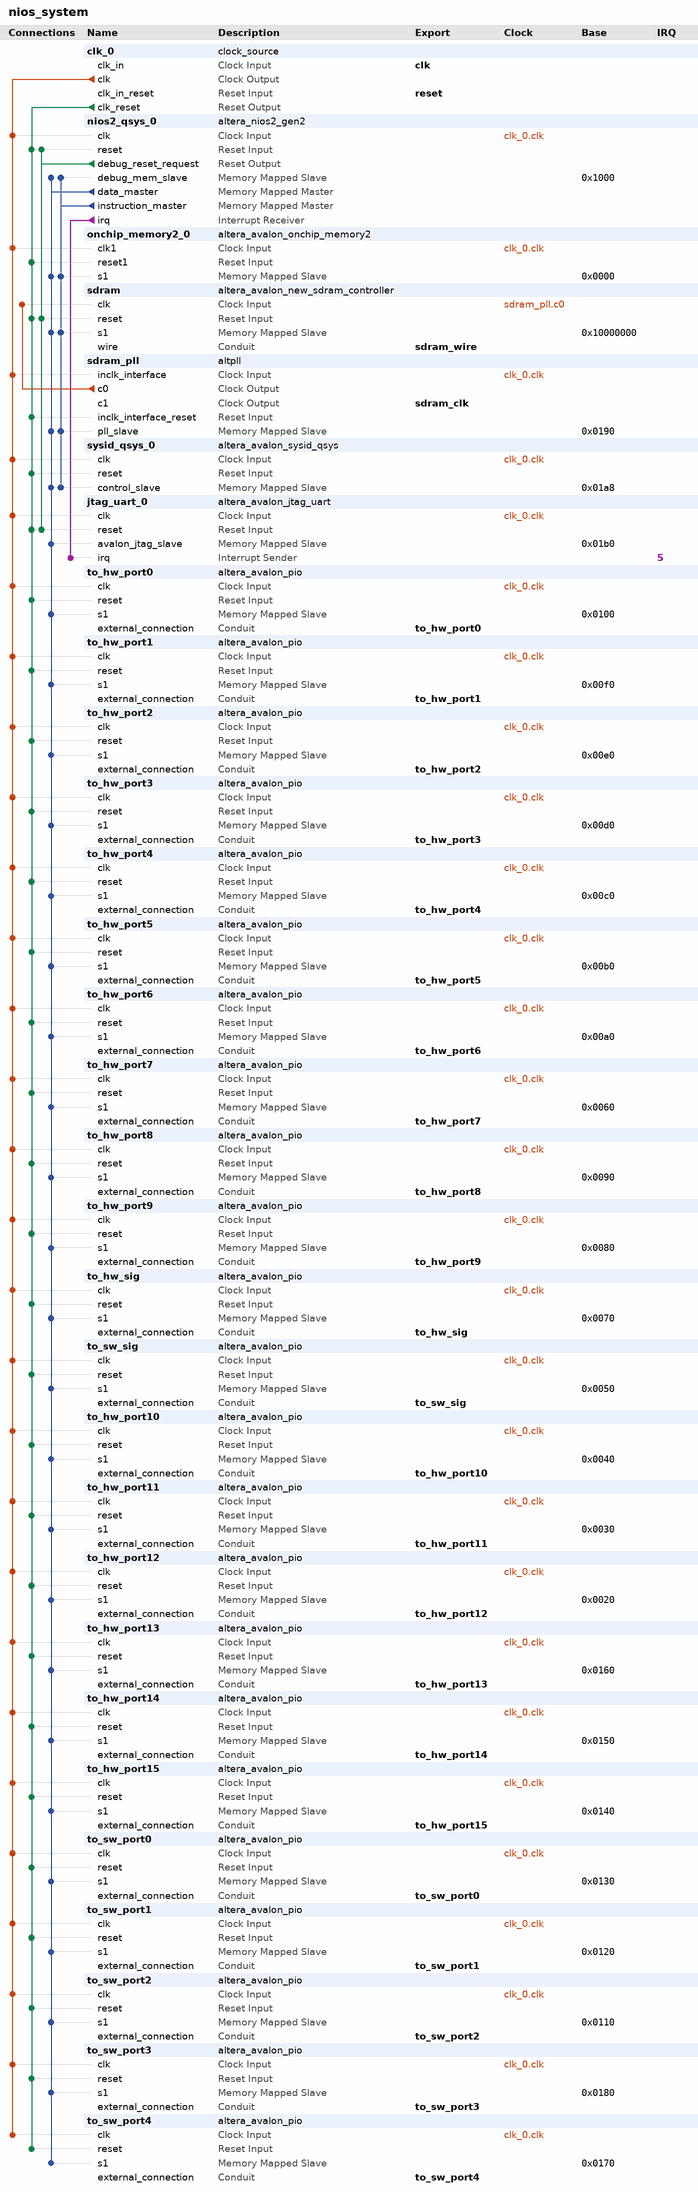
[diagram p0: system contents]
# Platform Designer (Qsys) system nios_system, Cyclone IV E EP4CE115F29C7
# Parameters at their usual value, and those the tool derives, are not listed.
package require -exact qsys 15.0
create_system nios_system
set_project_property DEVICE_FAMILY {Cyclone IV E}
set_project_property DEVICE EP4CE115F29C7

add_instance clk_0 clock_source 15.0
set_instance_parameter_value clk_0 clockFrequency 50000000

add_instance nios2_qsys_0 altera_nios2_gen2 15.0
set_instance_parameter_value nios2_qsys_0 dcache_size 2048
set_instance_parameter_value nios2_qsys_0 exceptionSlave sdram.s1
set_instance_parameter_value nios2_qsys_0 icache_size 4096
set_instance_parameter_value nios2_qsys_0 impl Tiny
set_instance_parameter_value nios2_qsys_0 resetSlave sdram.s1

add_instance onchip_memory2_0 altera_avalon_onchip_memory2 15.0
set_instance_parameter_value onchip_memory2_0 dataWidth 16
set_instance_parameter_value onchip_memory2_0 dualPort false
set_instance_parameter_value onchip_memory2_0 initMemContent true
set_instance_parameter_value onchip_memory2_0 initializationFileName onchip_mem.hex
set_instance_parameter_value onchip_memory2_0 memorySize 16

add_instance sdram altera_avalon_new_sdram_controller 15.0
set_instance_parameter_value sdram TAC 5.5
set_instance_parameter_value sdram TRCD 20.0
set_instance_parameter_value sdram TRP 20.0
set_instance_parameter_value sdram casLatency 3
set_instance_parameter_value sdram columnWidth 10
set_instance_parameter_value sdram dataWidth 32
set_instance_parameter_value sdram generateSimulationModel false
set_instance_parameter_value sdram model single_Micron_MT48LC4M32B2_7_chip
set_instance_parameter_value sdram numberOfBanks 4
set_instance_parameter_value sdram numberOfChipSelects 1
set_instance_parameter_value sdram powerUpDelay 200.0
set_instance_parameter_value sdram refreshPeriod 7.8125
set_instance_parameter_value sdram rowWidth 13

add_instance sdram_pll altpll 15.0
set_instance_parameter_value sdram_pll CLK0_DIVIDE_BY 1
set_instance_parameter_value sdram_pll CLK0_MULTIPLY_BY 1
set_instance_parameter_value sdram_pll CLK1_DIVIDE_BY 1
set_instance_parameter_value sdram_pll CLK1_DUTY_CYCLE 50
set_instance_parameter_value sdram_pll CLK1_MULTIPLY_BY 1
set_instance_parameter_value sdram_pll CLK1_PHASE_SHIFT -3000
set_instance_parameter_value sdram_pll INCLK0_INPUT_FREQUENCY 20000
set_instance_parameter_value sdram_pll PORT_ARESET PORT_UNUSED
set_instance_parameter_value sdram_pll PORT_LOCKED PORT_UNUSED
set_instance_parameter_value sdram_pll PORT_clk1 PORT_USED
set_instance_parameter_value sdram_pll PORT_clk2 PORT_UNUSED
set_instance_parameter_value sdram_pll PORT_clk3 PORT_UNUSED

add_instance sysid_qsys_0 altera_avalon_sysid_qsys 15.0
set_instance_parameter_value sysid_qsys_0 id 0

add_instance jtag_uart_0 altera_avalon_jtag_uart 15.0
set_instance_parameter_value jtag_uart_0 simInteractiveOptions NO_INTERACTIVE_WINDOWS

add_instance to_hw_port0 altera_avalon_pio 15.0
set_instance_parameter_value to_hw_port0 direction Output
set_instance_parameter_value to_hw_port0 width 32

add_instance to_hw_port1 altera_avalon_pio 15.0
set_instance_parameter_value to_hw_port1 direction Output
set_instance_parameter_value to_hw_port1 width 32

add_instance to_hw_port2 altera_avalon_pio 15.0
set_instance_parameter_value to_hw_port2 direction Output
set_instance_parameter_value to_hw_port2 width 32

add_instance to_hw_port3 altera_avalon_pio 15.0
set_instance_parameter_value to_hw_port3 direction Output
set_instance_parameter_value to_hw_port3 width 32

add_instance to_hw_port4 altera_avalon_pio 15.0
set_instance_parameter_value to_hw_port4 direction Output
set_instance_parameter_value to_hw_port4 width 32

add_instance to_hw_port5 altera_avalon_pio 15.0
set_instance_parameter_value to_hw_port5 direction Output
set_instance_parameter_value to_hw_port5 width 32

add_instance to_hw_port6 altera_avalon_pio 15.0
set_instance_parameter_value to_hw_port6 direction Output
set_instance_parameter_value to_hw_port6 width 32

add_instance to_hw_port7 altera_avalon_pio 15.0
set_instance_parameter_value to_hw_port7 direction Output
set_instance_parameter_value to_hw_port7 width 32

add_instance to_hw_port8 altera_avalon_pio 15.0
set_instance_parameter_value to_hw_port8 direction Output
set_instance_parameter_value to_hw_port8 width 32

add_instance to_hw_port9 altera_avalon_pio 15.0
set_instance_parameter_value to_hw_port9 direction Output
set_instance_parameter_value to_hw_port9 width 32

add_instance to_hw_sig altera_avalon_pio 15.0
set_instance_parameter_value to_hw_sig direction Output
set_instance_parameter_value to_hw_sig width 2

add_instance to_sw_sig altera_avalon_pio 15.0
set_instance_parameter_value to_sw_sig direction Input
set_instance_parameter_value to_sw_sig width 2

add_instance to_hw_port10 altera_avalon_pio 15.0
set_instance_parameter_value to_hw_port10 direction Output
set_instance_parameter_value to_hw_port10 width 32

add_instance to_hw_port11 altera_avalon_pio 15.0
set_instance_parameter_value to_hw_port11 direction Output
set_instance_parameter_value to_hw_port11 width 32

add_instance to_hw_port12 altera_avalon_pio 15.0
set_instance_parameter_value to_hw_port12 direction Output
set_instance_parameter_value to_hw_port12 width 32

add_instance to_hw_port13 altera_avalon_pio 15.0
set_instance_parameter_value to_hw_port13 direction Output
set_instance_parameter_value to_hw_port13 width 32

add_instance to_hw_port14 altera_avalon_pio 15.0
set_instance_parameter_value to_hw_port14 direction Output
set_instance_parameter_value to_hw_port14 width 32

add_instance to_hw_port15 altera_avalon_pio 15.0
set_instance_parameter_value to_hw_port15 direction Output
set_instance_parameter_value to_hw_port15 width 32

add_instance to_sw_port0 altera_avalon_pio 15.0
set_instance_parameter_value to_sw_port0 direction Input
set_instance_parameter_value to_sw_port0 width 32

add_instance to_sw_port1 altera_avalon_pio 15.0
set_instance_parameter_value to_sw_port1 direction Input
set_instance_parameter_value to_sw_port1 width 32

add_instance to_sw_port2 altera_avalon_pio 15.0
set_instance_parameter_value to_sw_port2 direction Input
set_instance_parameter_value to_sw_port2 width 8

add_instance to_sw_port3 altera_avalon_pio 15.0
set_instance_parameter_value to_sw_port3 direction Input
set_instance_parameter_value to_sw_port3 width 16

add_instance to_sw_port4 altera_avalon_pio 15.0
set_instance_parameter_value to_sw_port4 direction Input
set_instance_parameter_value to_sw_port4 width 16

# connections
add_connection clk_0.clk jtag_uart_0.clk clock
add_connection clk_0.clk nios2_qsys_0.clk clock
add_connection clk_0.clk onchip_memory2_0.clk1 clock
add_connection clk_0.clk sdram_pll.inclk_interface clock
add_connection clk_0.clk sysid_qsys_0.clk clock
add_connection clk_0.clk to_hw_port0.clk clock
add_connection clk_0.clk to_hw_port1.clk clock
add_connection clk_0.clk to_hw_port2.clk clock
add_connection clk_0.clk to_hw_port3.clk clock
add_connection clk_0.clk to_hw_port4.clk clock
add_connection clk_0.clk to_hw_port5.clk clock
add_connection clk_0.clk to_hw_port6.clk clock
add_connection clk_0.clk to_hw_port7.clk clock
add_connection clk_0.clk to_hw_port8.clk clock
add_connection clk_0.clk to_hw_port9.clk clock
add_connection clk_0.clk to_hw_port10.clk clock
add_connection clk_0.clk to_hw_port11.clk clock
add_connection clk_0.clk to_hw_port12.clk clock
add_connection clk_0.clk to_hw_port13.clk clock
add_connection clk_0.clk to_hw_port14.clk clock
add_connection clk_0.clk to_hw_port15.clk clock
add_connection clk_0.clk to_hw_sig.clk clock
add_connection clk_0.clk to_sw_port0.clk clock
add_connection clk_0.clk to_sw_port1.clk clock
add_connection clk_0.clk to_sw_port2.clk clock
add_connection clk_0.clk to_sw_port3.clk clock
add_connection clk_0.clk to_sw_port4.clk clock
add_connection clk_0.clk to_sw_sig.clk clock
add_connection sdram_pll.c0 sdram.clk clock
add_connection clk_0.clk_reset jtag_uart_0.reset reset
add_connection clk_0.clk_reset nios2_qsys_0.reset reset
add_connection clk_0.clk_reset onchip_memory2_0.reset1 reset
add_connection clk_0.clk_reset sdram.reset reset
add_connection clk_0.clk_reset sdram_pll.inclk_interface_reset reset
add_connection clk_0.clk_reset sysid_qsys_0.reset reset
add_connection clk_0.clk_reset to_hw_port0.reset reset
add_connection clk_0.clk_reset to_hw_port1.reset reset
add_connection clk_0.clk_reset to_hw_port2.reset reset
add_connection clk_0.clk_reset to_hw_port3.reset reset
add_connection clk_0.clk_reset to_hw_port4.reset reset
add_connection clk_0.clk_reset to_hw_port5.reset reset
add_connection clk_0.clk_reset to_hw_port6.reset reset
add_connection clk_0.clk_reset to_hw_port7.reset reset
add_connection clk_0.clk_reset to_hw_port8.reset reset
add_connection clk_0.clk_reset to_hw_port9.reset reset
add_connection clk_0.clk_reset to_hw_port10.reset reset
add_connection clk_0.clk_reset to_hw_port11.reset reset
add_connection clk_0.clk_reset to_hw_port12.reset reset
add_connection clk_0.clk_reset to_hw_port13.reset reset
add_connection clk_0.clk_reset to_hw_port14.reset reset
add_connection clk_0.clk_reset to_hw_port15.reset reset
add_connection clk_0.clk_reset to_hw_sig.reset reset
add_connection clk_0.clk_reset to_sw_port0.reset reset
add_connection clk_0.clk_reset to_sw_port1.reset reset
add_connection clk_0.clk_reset to_sw_port2.reset reset
add_connection clk_0.clk_reset to_sw_port3.reset reset
add_connection clk_0.clk_reset to_sw_port4.reset reset
add_connection clk_0.clk_reset to_sw_sig.reset reset
add_connection nios2_qsys_0.debug_reset_request jtag_uart_0.reset reset
add_connection nios2_qsys_0.debug_reset_request nios2_qsys_0.reset reset
add_connection nios2_qsys_0.debug_reset_request sdram.reset reset
add_connection nios2_qsys_0.data_master jtag_uart_0.avalon_jtag_slave avalon
set_connection_parameter_value nios2_qsys_0.data_master/jtag_uart_0.avalon_jtag_slave baseAddress 0x01b0
add_connection nios2_qsys_0.data_master nios2_qsys_0.debug_mem_slave avalon
set_connection_parameter_value nios2_qsys_0.data_master/nios2_qsys_0.debug_mem_slave baseAddress 0x1000
add_connection nios2_qsys_0.data_master onchip_memory2_0.s1 avalon
set_connection_parameter_value nios2_qsys_0.data_master/onchip_memory2_0.s1 baseAddress 0x0000
add_connection nios2_qsys_0.data_master sdram.s1 avalon
set_connection_parameter_value nios2_qsys_0.data_master/sdram.s1 baseAddress 0x10000000
add_connection nios2_qsys_0.data_master sdram_pll.pll_slave avalon
set_connection_parameter_value nios2_qsys_0.data_master/sdram_pll.pll_slave baseAddress 0x0190
add_connection nios2_qsys_0.data_master sysid_qsys_0.control_slave avalon
set_connection_parameter_value nios2_qsys_0.data_master/sysid_qsys_0.control_slave baseAddress 0x01a8
add_connection nios2_qsys_0.data_master to_hw_port0.s1 avalon
set_connection_parameter_value nios2_qsys_0.data_master/to_hw_port0.s1 baseAddress 0x0100
add_connection nios2_qsys_0.data_master to_hw_port1.s1 avalon
set_connection_parameter_value nios2_qsys_0.data_master/to_hw_port1.s1 baseAddress 0x00f0
add_connection nios2_qsys_0.data_master to_hw_port2.s1 avalon
set_connection_parameter_value nios2_qsys_0.data_master/to_hw_port2.s1 baseAddress 0x00e0
add_connection nios2_qsys_0.data_master to_hw_port3.s1 avalon
set_connection_parameter_value nios2_qsys_0.data_master/to_hw_port3.s1 baseAddress 0x00d0
add_connection nios2_qsys_0.data_master to_hw_port4.s1 avalon
set_connection_parameter_value nios2_qsys_0.data_master/to_hw_port4.s1 baseAddress 0x00c0
add_connection nios2_qsys_0.data_master to_hw_port5.s1 avalon
set_connection_parameter_value nios2_qsys_0.data_master/to_hw_port5.s1 baseAddress 0x00b0
add_connection nios2_qsys_0.data_master to_hw_port6.s1 avalon
set_connection_parameter_value nios2_qsys_0.data_master/to_hw_port6.s1 baseAddress 0x00a0
add_connection nios2_qsys_0.data_master to_hw_port7.s1 avalon
set_connection_parameter_value nios2_qsys_0.data_master/to_hw_port7.s1 baseAddress 0x0060
add_connection nios2_qsys_0.data_master to_hw_port8.s1 avalon
set_connection_parameter_value nios2_qsys_0.data_master/to_hw_port8.s1 baseAddress 0x0090
add_connection nios2_qsys_0.data_master to_hw_port9.s1 avalon
set_connection_parameter_value nios2_qsys_0.data_master/to_hw_port9.s1 baseAddress 0x0080
add_connection nios2_qsys_0.data_master to_hw_port10.s1 avalon
set_connection_parameter_value nios2_qsys_0.data_master/to_hw_port10.s1 baseAddress 0x0040
add_connection nios2_qsys_0.data_master to_hw_port11.s1 avalon
set_connection_parameter_value nios2_qsys_0.data_master/to_hw_port11.s1 baseAddress 0x0030
add_connection nios2_qsys_0.data_master to_hw_port12.s1 avalon
set_connection_parameter_value nios2_qsys_0.data_master/to_hw_port12.s1 baseAddress 0x0020
add_connection nios2_qsys_0.data_master to_hw_port13.s1 avalon
set_connection_parameter_value nios2_qsys_0.data_master/to_hw_port13.s1 baseAddress 0x0160
add_connection nios2_qsys_0.data_master to_hw_port14.s1 avalon
set_connection_parameter_value nios2_qsys_0.data_master/to_hw_port14.s1 baseAddress 0x0150
add_connection nios2_qsys_0.data_master to_hw_port15.s1 avalon
set_connection_parameter_value nios2_qsys_0.data_master/to_hw_port15.s1 baseAddress 0x0140
add_connection nios2_qsys_0.data_master to_hw_sig.s1 avalon
set_connection_parameter_value nios2_qsys_0.data_master/to_hw_sig.s1 baseAddress 0x0070
add_connection nios2_qsys_0.data_master to_sw_port0.s1 avalon
set_connection_parameter_value nios2_qsys_0.data_master/to_sw_port0.s1 baseAddress 0x0130
add_connection nios2_qsys_0.data_master to_sw_port1.s1 avalon
set_connection_parameter_value nios2_qsys_0.data_master/to_sw_port1.s1 baseAddress 0x0120
add_connection nios2_qsys_0.data_master to_sw_port2.s1 avalon
set_connection_parameter_value nios2_qsys_0.data_master/to_sw_port2.s1 baseAddress 0x0110
add_connection nios2_qsys_0.data_master to_sw_port3.s1 avalon
set_connection_parameter_value nios2_qsys_0.data_master/to_sw_port3.s1 baseAddress 0x0180
add_connection nios2_qsys_0.data_master to_sw_port4.s1 avalon
set_connection_parameter_value nios2_qsys_0.data_master/to_sw_port4.s1 baseAddress 0x0170
add_connection nios2_qsys_0.data_master to_sw_sig.s1 avalon
set_connection_parameter_value nios2_qsys_0.data_master/to_sw_sig.s1 baseAddress 0x0050
add_connection nios2_qsys_0.instruction_master nios2_qsys_0.debug_mem_slave avalon
set_connection_parameter_value nios2_qsys_0.instruction_master/nios2_qsys_0.debug_mem_slave baseAddress 0x1000
add_connection nios2_qsys_0.instruction_master onchip_memory2_0.s1 avalon
set_connection_parameter_value nios2_qsys_0.instruction_master/onchip_memory2_0.s1 baseAddress 0x0000
add_connection nios2_qsys_0.instruction_master sdram.s1 avalon
set_connection_parameter_value nios2_qsys_0.instruction_master/sdram.s1 baseAddress 0x10000000
add_connection nios2_qsys_0.instruction_master sdram_pll.pll_slave avalon
set_connection_parameter_value nios2_qsys_0.instruction_master/sdram_pll.pll_slave baseAddress 0x0190
add_connection nios2_qsys_0.instruction_master sysid_qsys_0.control_slave avalon
set_connection_parameter_value nios2_qsys_0.instruction_master/sysid_qsys_0.control_slave baseAddress 0x01a8
add_connection nios2_qsys_0.irq jtag_uart_0.irq interrupt
set_connection_parameter_value nios2_qsys_0.irq/jtag_uart_0.irq irqNumber 5

# exported interfaces
add_interface clk clock sink
set_interface_property clk EXPORT_OF clk_0.clk_in
add_interface reset reset sink
set_interface_property reset EXPORT_OF clk_0.clk_in_reset
add_interface sdram_clk clock source
set_interface_property sdram_clk EXPORT_OF sdram_pll.c1
add_interface sdram_wire conduit end
set_interface_property sdram_wire EXPORT_OF sdram.wire
add_interface to_hw_port0 conduit end
set_interface_property to_hw_port0 EXPORT_OF to_hw_port0.external_connection
add_interface to_hw_port1 conduit end
set_interface_property to_hw_port1 EXPORT_OF to_hw_port1.external_connection
add_interface to_hw_port10 conduit end
set_interface_property to_hw_port10 EXPORT_OF to_hw_port10.external_connection
add_interface to_hw_port11 conduit end
set_interface_property to_hw_port11 EXPORT_OF to_hw_port11.external_connection
add_interface to_hw_port12 conduit end
set_interface_property to_hw_port12 EXPORT_OF to_hw_port12.external_connection
add_interface to_hw_port13 conduit end
set_interface_property to_hw_port13 EXPORT_OF to_hw_port13.external_connection
add_interface to_hw_port14 conduit end
set_interface_property to_hw_port14 EXPORT_OF to_hw_port14.external_connection
add_interface to_hw_port15 conduit end
set_interface_property to_hw_port15 EXPORT_OF to_hw_port15.external_connection
add_interface to_hw_port2 conduit end
set_interface_property to_hw_port2 EXPORT_OF to_hw_port2.external_connection
add_interface to_hw_port3 conduit end
set_interface_property to_hw_port3 EXPORT_OF to_hw_port3.external_connection
add_interface to_hw_port4 conduit end
set_interface_property to_hw_port4 EXPORT_OF to_hw_port4.external_connection
add_interface to_hw_port5 conduit end
set_interface_property to_hw_port5 EXPORT_OF to_hw_port5.external_connection
add_interface to_hw_port6 conduit end
set_interface_property to_hw_port6 EXPORT_OF to_hw_port6.external_connection
add_interface to_hw_port7 conduit end
set_interface_property to_hw_port7 EXPORT_OF to_hw_port7.external_connection
add_interface to_hw_port8 conduit end
set_interface_property to_hw_port8 EXPORT_OF to_hw_port8.external_connection
add_interface to_hw_port9 conduit end
set_interface_property to_hw_port9 EXPORT_OF to_hw_port9.external_connection
add_interface to_hw_sig conduit end
set_interface_property to_hw_sig EXPORT_OF to_hw_sig.external_connection
add_interface to_sw_port0 conduit end
set_interface_property to_sw_port0 EXPORT_OF to_sw_port0.external_connection
add_interface to_sw_port1 conduit end
set_interface_property to_sw_port1 EXPORT_OF to_sw_port1.external_connection
add_interface to_sw_port2 conduit end
set_interface_property to_sw_port2 EXPORT_OF to_sw_port2.external_connection
add_interface to_sw_port3 conduit end
set_interface_property to_sw_port3 EXPORT_OF to_sw_port3.external_connection
add_interface to_sw_port4 conduit end
set_interface_property to_sw_port4 EXPORT_OF to_sw_port4.external_connection
add_interface to_sw_sig conduit end
set_interface_property to_sw_sig EXPORT_OF to_sw_sig.external_connection

set_interconnect_requirement {$system} qsys_mm.clockCrossingAdapter HANDSHAKE
set_interconnect_requirement {$system} qsys_mm.enableEccProtection FALSE
set_interconnect_requirement {$system} qsys_mm.insertDefaultSlave FALSE
set_interconnect_requirement {$system} qsys_mm.maxAdditionalLatency 1

save_system nios_system.qsys
